# Altium schematic sheet Sheet2.SchDoc
size 292 x 193 mm; Author: Mikołaj Roszczyk; SheetNumber: 1; SheetTotal: 1
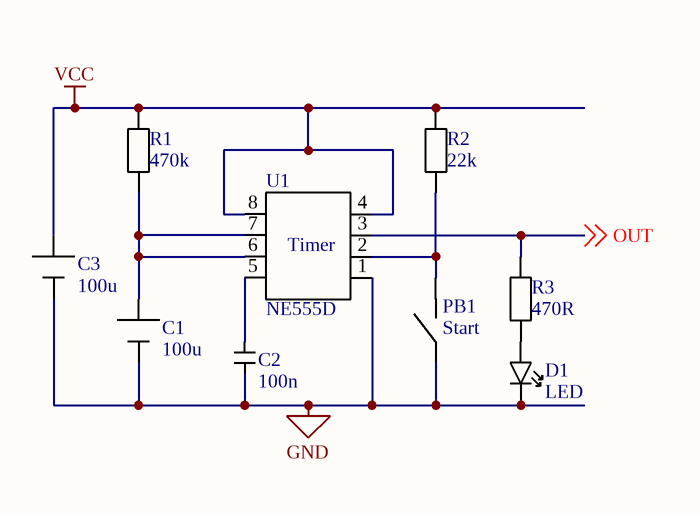
[diagram p0: Sheet2.SchDoc]

## Parts
C1  100u
C2  100n
C3  100u
D1  LED
PB1  Start
R1  470k
R2  22k
R3  470R
U1  NE555D

## Nets
GND: C1.- C2.?1 C3.- D1.OUT PB1.8 U1.1
VCC: C3.+ R1.0 R2.0 U1.4 U1.8
OUT: R3.0 U1.3 ; off-sheet OUT
NetC1_+: C1.+ R1.1 U1.6 U1.7
NetC2_?2: C2.?2 U1.5
NetD1_IN: D1.IN R3.1
NetPB1_9: PB1.9 R2.1 U1.2

## Notes on the sheet
- (near U1) Timer
- Data:
- Tytuł:
- Rev.:
- Rozm.:
- A4
- Strona:
- z
- PBL4
- Opracował:

## Library data of the parts
C1 C3 = battery
C2 = Capacitor
PB1 = Button
R1-R3 = Resistor: Value: 10k0